# EAGLE schematic yacc1 (EAGLE 6.5.0)

## Sheet 1 of 3
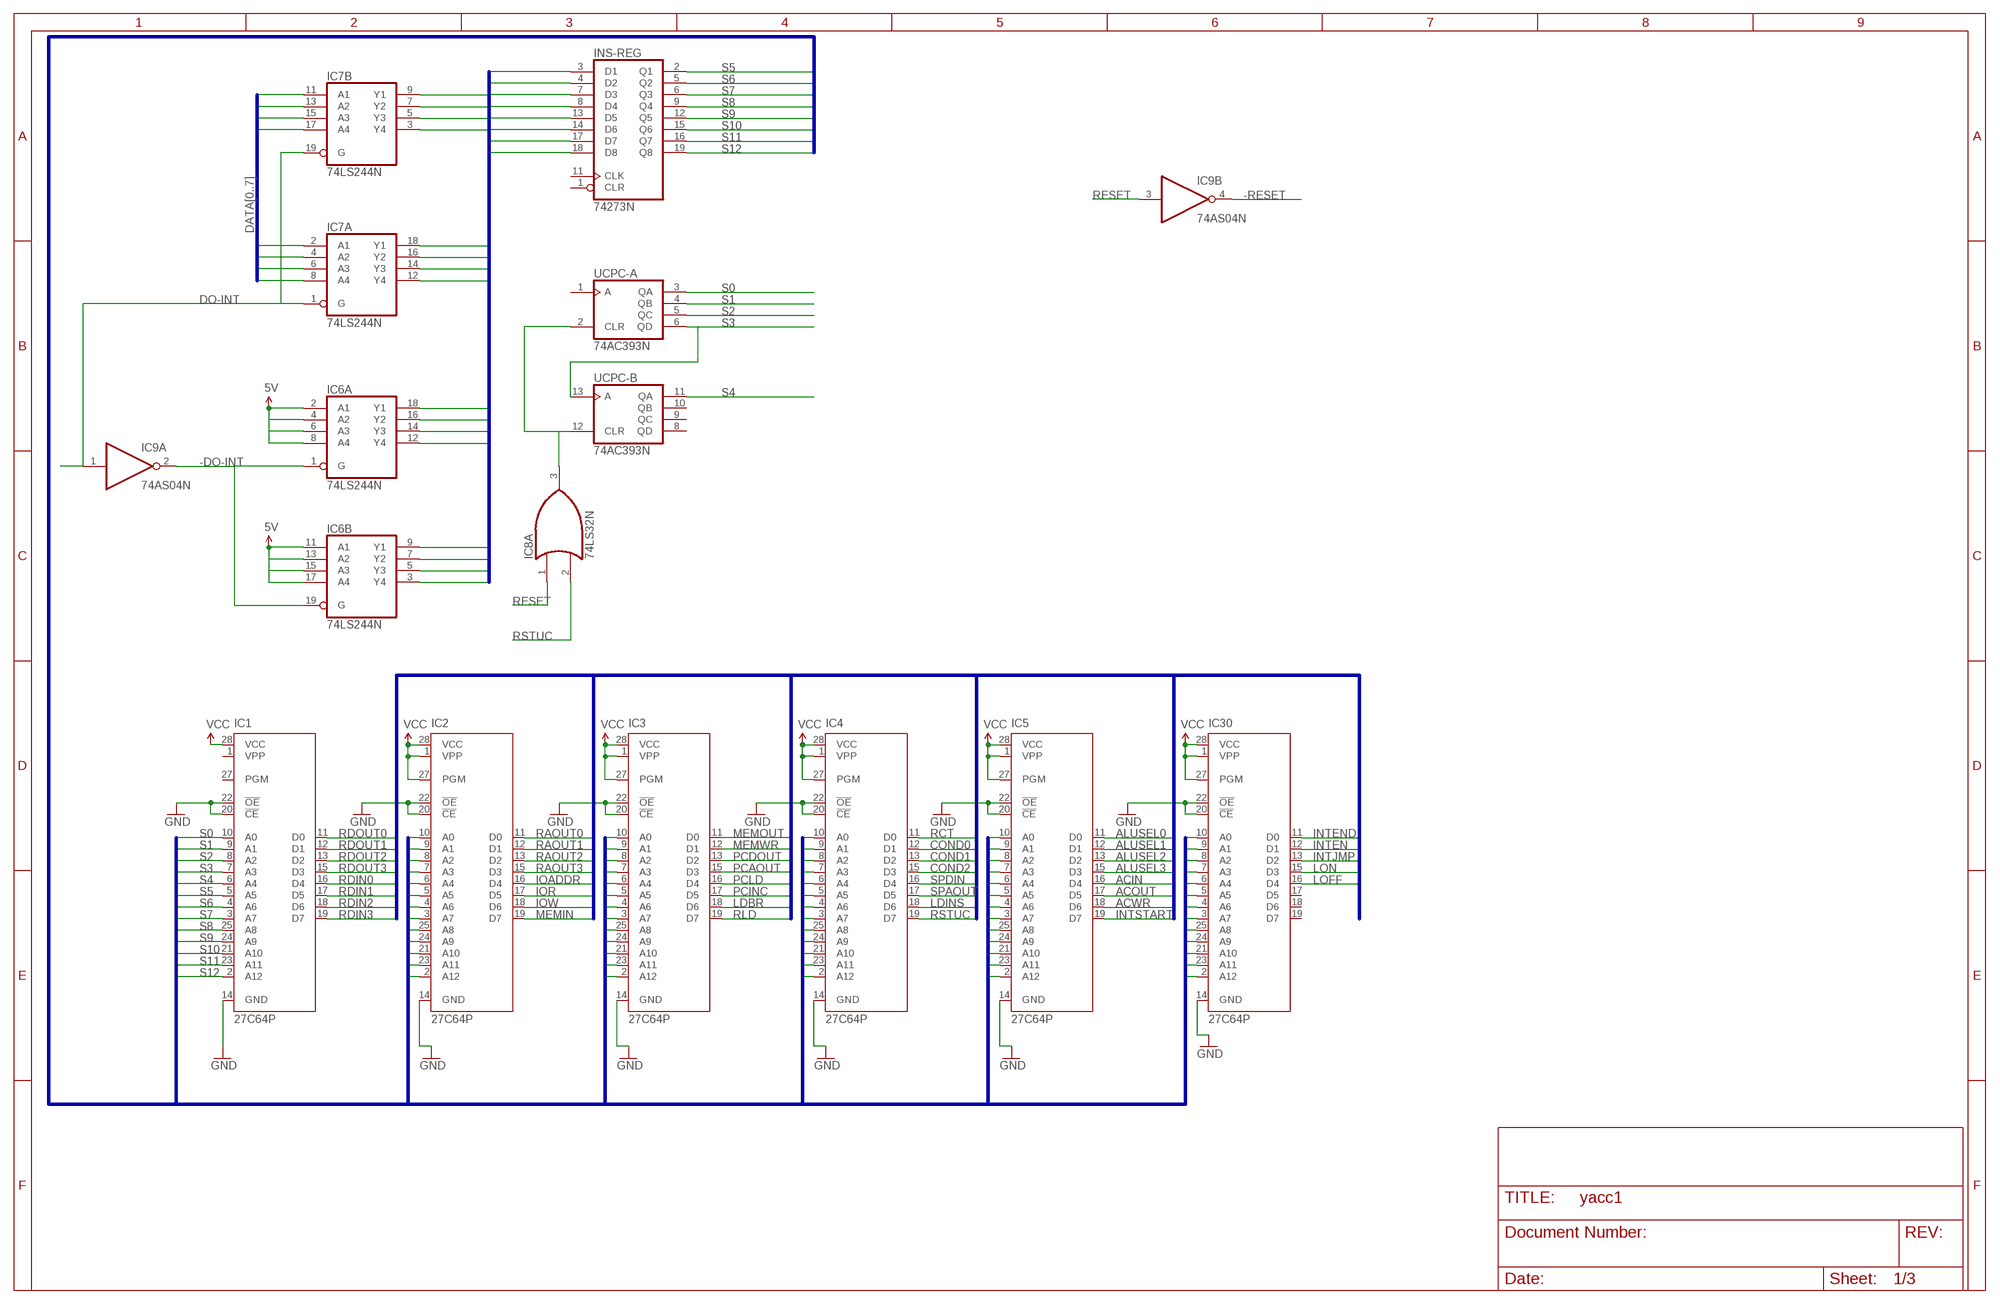
[diagram p0: schematic, sheet 1]

### Parts
IC1  27C64P  [DIL28-6]
IC2  27C64P  [DIL28-6]
IC3  27C64P  [DIL28-6]
IC4  27C64P  [DIL28-6]
IC5  27C64P  [DIL28-6]
IC6  74LS244N  [DIL20]
IC7  74LS244N  [DIL20]
IC8  74LS32N  [DIL14]
IC9  74AS04N  [DIL14]
IC30  27C64P  [DIL28-6]
INS-REG  74273N  [DIL20]
UCPC-  74AC393N  [DIL14]

### Nets
5V: IC6.2(A:A1) IC6.4(A:A2) IC6.6(A:A3) IC6.8(A:A4) IC6.11(B:A1) IC6.13(B:A2) IC6.15(B:A3) IC6.17(B:A4)
-DO-INT: IC6.1(A:G) IC6.19(B:G) IC9.2(A:O)
-RESET: IC9.4(B:O) ; also sheet 2
ACIN: IC5.16(D4)
ACOUT: IC5.17(D5)
ACWR: IC5.18(D6)
ALUSEL0: IC5.11(D0)
ALUSEL1: IC5.12(D1)
ALUSEL2: IC5.13(D2)
ALUSEL3: IC5.15(D3)
COND0: IC4.12(D1)
COND1: IC4.13(D2)
COND2: IC4.15(D3)
DATA0: IC7.11(B:A1) ; also sheet 2,3
DATA1: IC7.13(B:A2) ; also sheet 2,3
DATA2: IC7.15(B:A3) ; also sheet 2,3
DATA3: IC7.17(B:A4) ; also sheet 2,3
DATA4: IC7.2(A:A1) ; also sheet 2,3
DATA5: IC7.4(A:A2) ; also sheet 2,3
DATA6: IC7.6(A:A3) ; also sheet 2,3
DATA7: IC7.8(A:A4) ; also sheet 2,3
DINS0: IC6.18(A:Y1) IC7.9(B:Y1) INS-REG.3(D1)
DINS1: IC6.16(A:Y2) IC7.7(B:Y2) INS-REG.4(D2)
DINS2: IC6.14(A:Y3) IC7.5(B:Y3) INS-REG.7(D3)
DINS3: IC6.12(A:Y4) IC7.3(B:Y4) INS-REG.8(D4)
DINS4: IC6.9(B:Y1) IC7.18(A:Y1) INS-REG.13(D5)
DINS5: IC6.7(B:Y2) IC7.16(A:Y2) INS-REG.14(D6)
DINS6: IC6.5(B:Y3) IC7.14(A:Y3) INS-REG.17(D7)
DINS7: IC6.3(B:Y4) IC7.12(A:Y4) INS-REG.18(D8)
DO-INT: IC7.1(A:G) IC7.19(B:G) IC9.1(A:I)
GND: IC1.14(GND) IC1.20(!CE) IC1.22(!OE) IC2.14(GND) IC2.20(!CE) IC2.22(!OE) IC3.14(GND) IC3.20(!CE) IC3.22(!OE) IC4.14(GND) IC4.20(!CE) IC4.22(!OE) IC5.14(GND) IC5.20(!CE) IC5.22(!OE) IC30.14(GND) IC30.20(!CE) IC30.22(!OE)
INTEN: IC30.12(D1)
INTEND: IC30.11(D0)
INTJMP: IC30.13(D2)
INTSTART: IC5.19(D7)
IOADDR: IC2.16(D4)
IOR: IC2.17(D5)
IOW: IC2.18(D6)
LDBR: IC3.18(D6)
LDINS: IC4.18(D6)
LOFF: IC30.16(D4)
LON: IC30.15(D3)
MEMIN: IC2.19(D7)
MEMOUT: IC3.11(D0)
MEMWR: IC3.12(D1)
N$1: IC8.3(A:O) UCPC-.2(A:CLR) UCPC-.12(B:CLR)
PCAOUT: IC3.15(D3) ; also sheet 3
PCDOUT: IC3.13(D2) ; also sheet 3
PCINC: IC3.17(D5)
PCLD: IC3.16(D4)
RAOUT0: IC2.11(D0) ; also sheet 2
RAOUT1: IC2.12(D1) ; also sheet 2
RAOUT2: IC2.13(D2) ; also sheet 2
RAOUT3: IC2.15(D3) ; also sheet 2
RCT: IC4.11(D0)
RDIN0: IC1.16(D4) ; also sheet 2
RDIN1: IC1.17(D5) ; also sheet 2
RDIN2: IC1.18(D6) ; also sheet 2
RDIN3: IC1.19(D7) ; also sheet 2
RDOUT0: IC1.11(D0) ; also sheet 2
RDOUT1: IC1.12(D1) ; also sheet 2
RDOUT2: IC1.13(D2) ; also sheet 2
RDOUT3: IC1.15(D3) ; also sheet 2
RESET: IC8.1(A:I0) IC9.3(B:I)
RLD: IC3.19(D7)
RSTUC: IC4.19(D7) IC8.2(A:I1)
S0: IC1.10(A0) IC2.10(A0) IC3.10(A0) IC4.10(A0) IC5.10(A0) IC30.10(A0) UCPC-.3(A:QA)
S1: IC1.9(A1) IC2.9(A1) IC3.9(A1) IC4.9(A1) IC5.9(A1) IC30.9(A1) UCPC-.4(A:QB)
S2: IC1.8(A2) IC2.8(A2) IC3.8(A2) IC4.8(A2) IC5.8(A2) IC30.8(A2) UCPC-.5(A:QC)
S3: IC1.7(A3) IC2.7(A3) IC3.7(A3) IC4.7(A3) IC5.7(A3) IC30.7(A3) UCPC-.6(A:QD) UCPC-.13(B:A)
S4: IC1.6(A4) IC2.6(A4) IC3.6(A4) IC4.6(A4) IC5.6(A4) IC30.6(A4) UCPC-.11(B:QA)
S5: IC1.5(A5) IC2.5(A5) IC3.5(A5) IC4.5(A5) IC5.5(A5) IC30.5(A5) INS-REG.2(Q1)
S6: IC1.4(A6) IC2.4(A6) IC3.4(A6) IC4.4(A6) IC5.4(A6) IC30.4(A6) INS-REG.5(Q2)
S7: IC1.3(A7) IC2.3(A7) IC3.3(A7) IC4.3(A7) IC5.3(A7) IC30.3(A7) INS-REG.6(Q3)
S8: IC1.25(A8) IC2.25(A8) IC3.25(A8) IC4.25(A8) IC5.25(A8) IC30.25(A8) INS-REG.9(Q4)
S9: IC1.24(A9) IC2.24(A9) IC3.24(A9) IC4.24(A9) IC5.24(A9) IC30.24(A9) INS-REG.12(Q5)
S10: IC1.21(A10) IC2.21(A10) IC3.21(A10) IC4.21(A10) IC5.21(A10) IC30.21(A10) INS-REG.15(Q6)
S11: IC1.23(A11) IC2.23(A11) IC3.23(A11) IC4.23(A11) IC5.23(A11) IC30.23(A11) INS-REG.16(Q7)
S12: IC1.2(A12) IC2.2(A12) IC3.2(A12) IC4.2(A12) IC5.2(A12) IC30.2(A12) INS-REG.19(Q8)
SPAOUT: IC4.17(D5) ; also sheet 3
SPDIN: IC4.16(D4)
VCC: IC1.28(VCC) IC2.1(VPP) IC2.27(PGM) IC2.28(VCC) IC3.1(VPP) IC3.27(PGM) IC3.28(VCC) IC4.1(VPP) IC4.27(PGM) IC4.28(VCC) IC5.1(VPP) IC5.27(PGM) IC5.28(VCC) IC30.1(VPP) IC30.27(PGM) IC30.28(VCC)
Unconnected: IC1.1(VPP) IC1.26(NC) IC1.27(PGM) IC2.26(NC) IC3.26(NC) IC4.26(NC) IC5.26(NC) IC8.4(B:I0) IC8.5(B:I1) IC8.6(B:O) IC8.8(C:O) IC8.9(C:I0) IC8.10(C:I1) IC8.11(D:O) IC8.12(D:I0) IC8.13(D:I1) IC9.5(C:I) IC9.6(C:O) IC9.8(D:O) IC9.9(D:I) IC9.10(E:O) IC9.11(E:I) IC9.12(F:O) IC9.13(F:I) IC30.17(D5) IC30.18(D6) IC30.19(D7) IC30.26(NC) INS-REG.1(CLR) INS-REG.11(CLK) UCPC-.1(A:A) UCPC-.8(B:QD) UCPC-.9(B:QC) UCPC-.10(B:QB)

### Buses
S[0..12]
RDOUT[0..3],RDIN[0..3],RAOUT[0..3],IOADDR,IOR,IOW,MEMIN,MEMOUT,MEMWR,MEMRD,PCDOUT,PCAOUT,PCLD,PCINC,LDBR,RLD,RCT,COND[0..2],SPDIN,SPAOUT,LDINS,RSTUC,ALUSEL[0..3],ACIN,ACOUT,ACWR,INTSTART,INTEND,INTEN,INTJMP,LON,LOFF
DINS[0..7]
DATA[0..7]

## Sheet 2 of 3
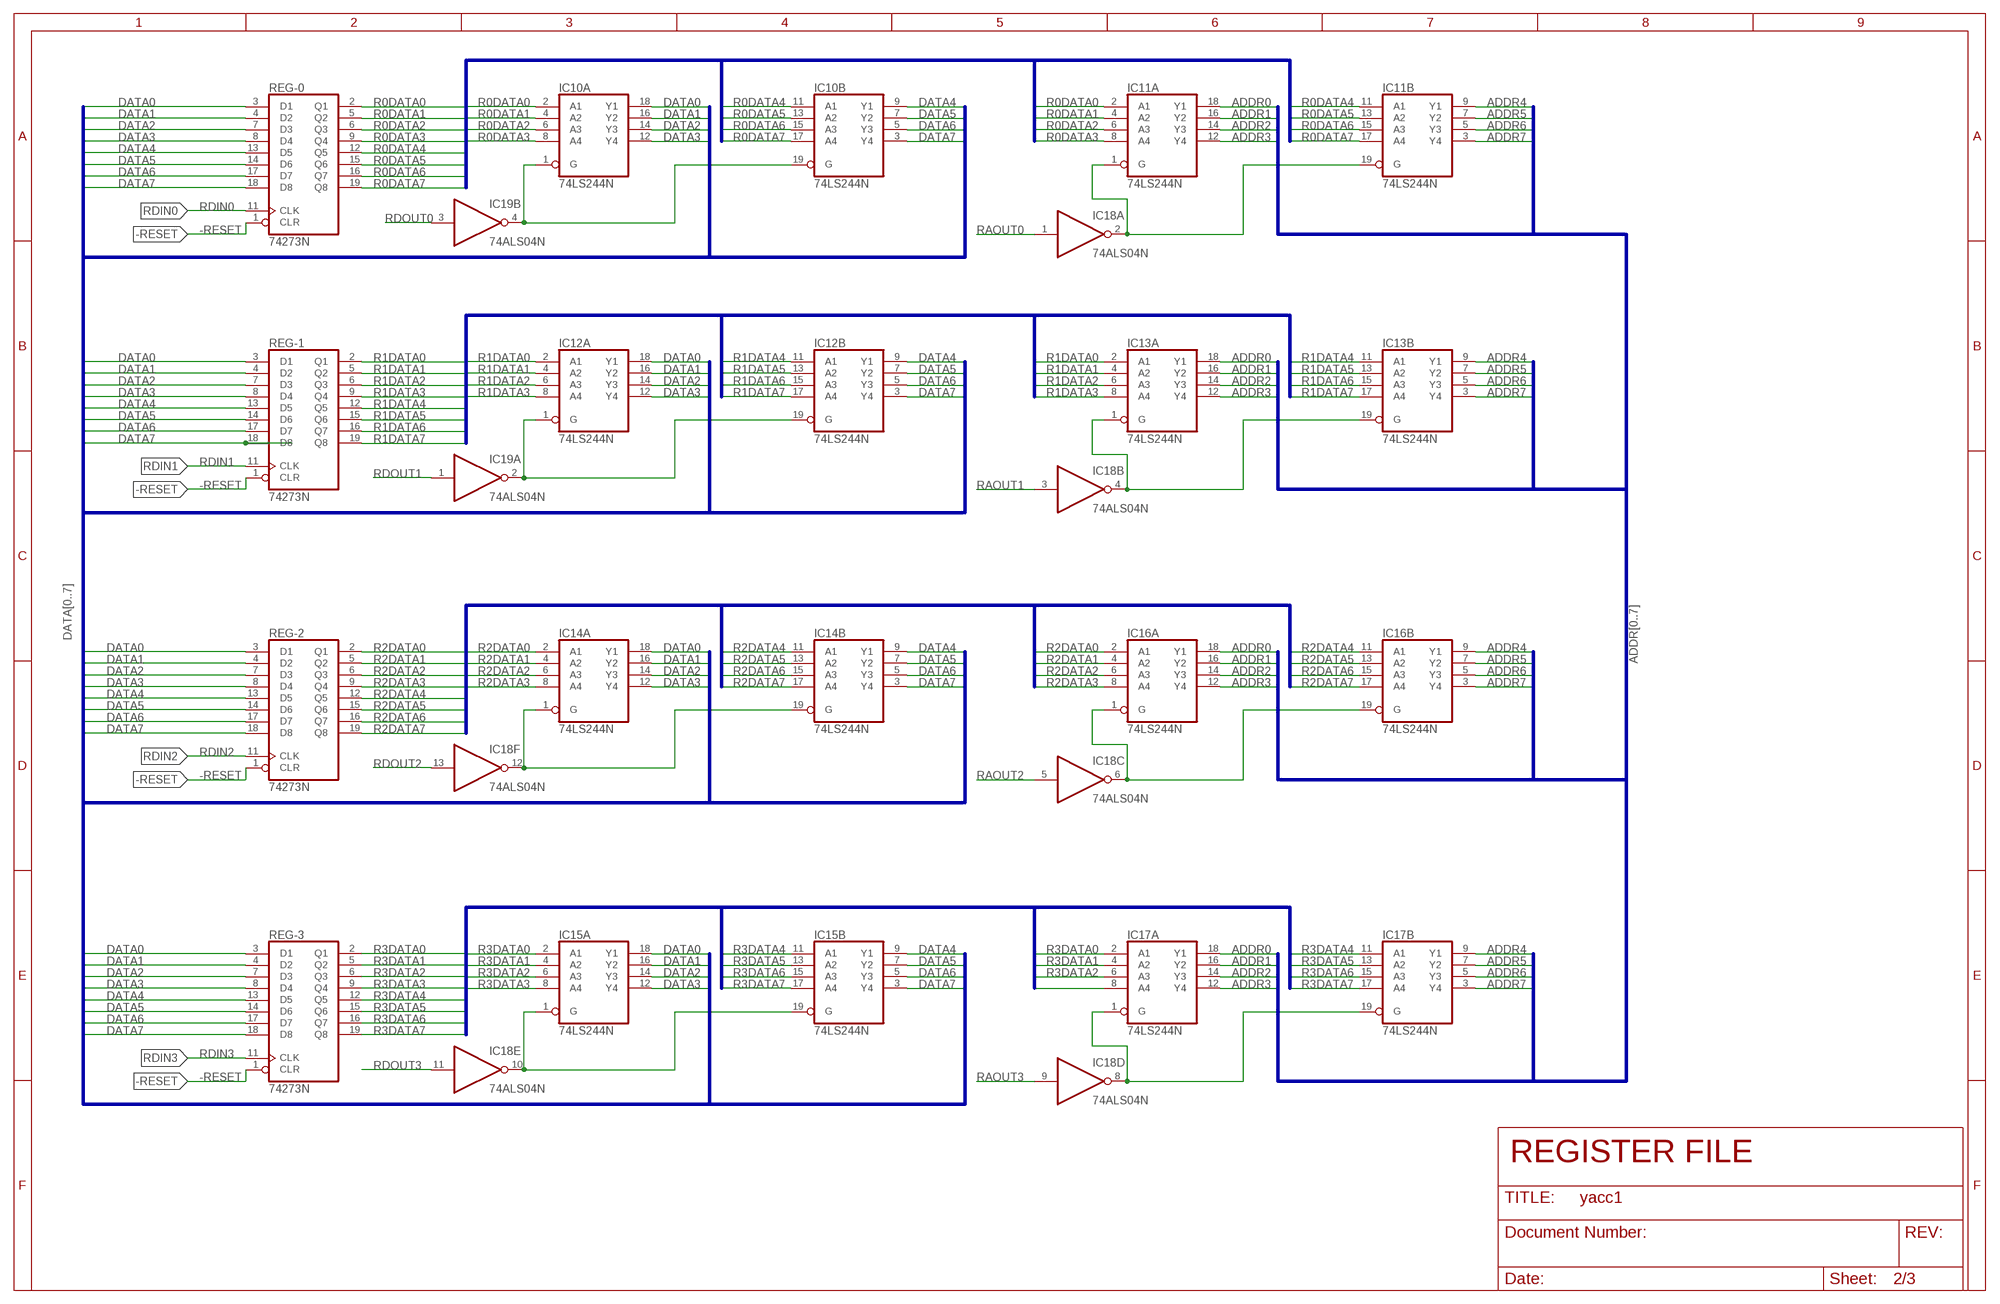
[diagram p1: schematic, sheet 2]

### Parts
IC10  74LS244N  [DIL20]
IC11  74LS244N  [DIL20]
IC12  74LS244N  [DIL20]
IC13  74LS244N  [DIL20]
IC14  74LS244N  [DIL20]
IC15  74LS244N  [DIL20]
IC16  74LS244N  [DIL20]
IC17  74LS244N  [DIL20]
IC18  74ALS04N  [DIL14]
IC19  74ALS04N  [DIL14]
REG-0  74273N  [DIL20]
REG-1  74273N  [DIL20]
REG-2  74273N  [DIL20]
REG-3  74273N  [DIL20]

### Nets
-RESET: REG-0.1(CLR) REG-1.1(CLR) REG-2.1(CLR) REG-3.1(CLR) ; also sheet 1
ADDR0: IC11.18(A:Y1) IC13.18(A:Y1) IC16.18(A:Y1) IC17.18(A:Y1) ; also sheet 3
ADDR1: IC11.16(A:Y2) IC13.16(A:Y2) IC16.16(A:Y2) IC17.16(A:Y2)
ADDR2: IC11.14(A:Y3) IC13.14(A:Y3) IC16.14(A:Y3) IC17.14(A:Y3) ; also sheet 3
ADDR3: IC11.12(A:Y4) IC13.12(A:Y4) IC16.12(A:Y4) IC17.12(A:Y4) ; also sheet 3
ADDR4: IC11.9(B:Y1) IC13.9(B:Y1) IC16.9(B:Y1) IC17.9(B:Y1) ; also sheet 3
ADDR5: IC11.7(B:Y2) IC13.7(B:Y2) IC16.7(B:Y2) IC17.7(B:Y2) ; also sheet 3
ADDR6: IC11.5(B:Y3) IC13.5(B:Y3) IC16.5(B:Y3) IC17.5(B:Y3) ; also sheet 3
ADDR7: IC11.3(B:Y4) IC13.3(B:Y4) IC16.3(B:Y4) IC17.3(B:Y4) ; also sheet 3
DATA0: IC10.18(A:Y1) IC12.18(A:Y1) IC14.18(A:Y1) IC15.18(A:Y1) REG-0.3(D1) REG-1.3(D1) REG-2.3(D1) REG-3.3(D1) ; also sheet 1,3
DATA1: IC10.16(A:Y2) IC12.16(A:Y2) IC14.16(A:Y2) IC15.16(A:Y2) REG-0.4(D2) REG-1.4(D2) REG-2.4(D2) REG-3.4(D2) ; also sheet 1,3
DATA2: IC10.14(A:Y3) IC12.14(A:Y3) IC14.14(A:Y3) IC15.14(A:Y3) REG-0.7(D3) REG-1.7(D3) REG-2.7(D3) REG-3.7(D3) ; also sheet 1,3
DATA3: IC10.12(A:Y4) IC12.12(A:Y4) IC14.12(A:Y4) IC15.12(A:Y4) REG-0.8(D4) REG-1.8(D4) REG-2.8(D4) REG-3.8(D4) ; also sheet 1,3
DATA4: IC10.9(B:Y1) IC12.9(B:Y1) IC14.9(B:Y1) IC15.9(B:Y1) REG-0.13(D5) REG-1.13(D5) REG-2.13(D5) REG-3.13(D5) ; also sheet 1,3
DATA5: IC10.7(B:Y2) IC12.7(B:Y2) IC14.7(B:Y2) IC15.7(B:Y2) REG-0.14(D6) REG-1.14(D6) REG-2.14(D6) REG-3.14(D6) ; also sheet 1,3
DATA6: IC10.5(B:Y3) IC12.5(B:Y3) IC14.5(B:Y3) IC15.5(B:Y3) REG-0.17(D7) REG-1.17(D7) REG-2.17(D7) REG-3.17(D7) ; also sheet 1,3
DATA7: IC10.3(B:Y4) IC12.3(B:Y4) IC14.3(B:Y4) IC15.3(B:Y4) REG-0.18(D8) REG-1.18(D8) REG-2.18(D8) REG-3.18(D8) ; also sheet 1,3
N$2: IC11.1(A:G) IC11.19(B:G) IC18.2(A:O)
N$3: IC13.1(A:G) IC13.19(B:G) IC18.4(B:O)
N$4: IC16.1(A:G) IC16.19(B:G) IC18.6(C:O)
N$5: IC17.1(A:G) IC17.19(B:G) IC18.8(D:O)
N$6: IC10.1(A:G) IC10.19(B:G) IC19.4(B:O)
N$7: IC12.1(A:G) IC12.19(B:G) IC19.2(A:O)
N$8: IC14.1(A:G) IC14.19(B:G) IC18.12(F:O)
N$9: IC15.1(A:G) IC15.19(B:G) IC18.10(E:O)
R0DATA0: IC10.2(A:A1) IC11.2(A:A1) REG-0.2(Q1)
R0DATA1: IC10.4(A:A2) IC11.4(A:A2) REG-0.5(Q2)
R0DATA2: IC10.6(A:A3) IC11.6(A:A3) REG-0.6(Q3)
R0DATA3: IC10.8(A:A4) IC11.8(A:A4) REG-0.9(Q4)
R0DATA4: IC10.11(B:A1) IC11.11(B:A1) REG-0.12(Q5)
R0DATA5: IC10.13(B:A2) IC11.13(B:A2) REG-0.15(Q6)
R0DATA6: IC10.15(B:A3) IC11.15(B:A3) REG-0.16(Q7)
R0DATA7: IC10.17(B:A4) IC11.17(B:A4) REG-0.19(Q8)
R1DATA0: IC12.2(A:A1) IC13.2(A:A1) REG-1.2(Q1)
R1DATA1: IC12.4(A:A2) IC13.4(A:A2) REG-1.5(Q2)
R1DATA2: IC12.6(A:A3) IC13.6(A:A3) REG-1.6(Q3)
R1DATA3: IC12.8(A:A4) IC13.8(A:A4) REG-1.9(Q4)
R1DATA4: IC12.11(B:A1) IC13.11(B:A1) REG-1.12(Q5)
R1DATA5: IC12.13(B:A2) IC13.13(B:A2) REG-1.15(Q6)
R1DATA6: IC12.15(B:A3) IC13.15(B:A3) REG-1.16(Q7)
R1DATA7: IC12.17(B:A4) IC13.17(B:A4) REG-1.19(Q8)
R2DATA0: IC14.2(A:A1) IC16.2(A:A1) REG-2.2(Q1)
R2DATA1: IC14.4(A:A2) IC16.4(A:A2) REG-2.5(Q2)
R2DATA2: IC14.6(A:A3) IC16.6(A:A3) REG-2.6(Q3)
R2DATA3: IC14.8(A:A4) IC16.8(A:A4) REG-2.9(Q4)
R2DATA4: IC14.11(B:A1) IC16.11(B:A1) REG-2.12(Q5)
R2DATA5: IC14.13(B:A2) IC16.13(B:A2) REG-2.15(Q6)
R2DATA6: IC14.15(B:A3) IC16.15(B:A3) REG-2.16(Q7)
R2DATA7: IC14.17(B:A4) IC16.17(B:A4) REG-2.19(Q8)
R3DATA0: IC15.2(A:A1) IC17.2(A:A1) REG-3.2(Q1)
R3DATA1: IC15.4(A:A2) IC17.4(A:A2) REG-3.5(Q2)
R3DATA2: IC15.6(A:A3) IC17.6(A:A3) REG-3.6(Q3)
R3DATA3: IC15.8(A:A4) IC17.8(A:A4) REG-3.9(Q4)
R3DATA4: IC15.11(B:A1) IC17.11(B:A1) REG-3.12(Q5)
R3DATA5: IC15.13(B:A2) IC17.13(B:A2) REG-3.15(Q6)
R3DATA6: IC15.15(B:A3) IC17.15(B:A3) REG-3.16(Q7)
R3DATA7: IC15.17(B:A4) IC17.17(B:A4) REG-3.19(Q8)
RAOUT0: IC18.1(A:I) ; also sheet 1
RAOUT1: IC18.3(B:I) ; also sheet 1
RAOUT2: IC18.5(C:I) ; also sheet 1
RAOUT3: IC18.9(D:I) ; also sheet 1
RDIN0: REG-0.11(CLK) ; also sheet 1
RDIN1: REG-1.11(CLK) ; also sheet 1
RDIN2: REG-2.11(CLK) ; also sheet 1
RDIN3: REG-3.11(CLK) ; also sheet 1
RDOUT0: IC19.3(B:I) ; also sheet 1
RDOUT1: IC19.1(A:I) ; also sheet 1
RDOUT2: IC18.13(F:I) ; also sheet 1
RDOUT3: IC18.11(E:I) ; also sheet 1
Unconnected: IC19.5(C:I) IC19.6(C:O) IC19.8(D:O) IC19.9(D:I) IC19.10(E:O) IC19.11(E:I) IC19.12(F:O) IC19.13(F:I)

### Buses
DATA[0..7]
ADDR[0..7]
R0DATA[0..7]
R1DATA[0..7]
R2DATA[0..7]
R3DATA[0..7]

### Notes on the sheet
- REGISTER FILE

## Sheet 3 of 3
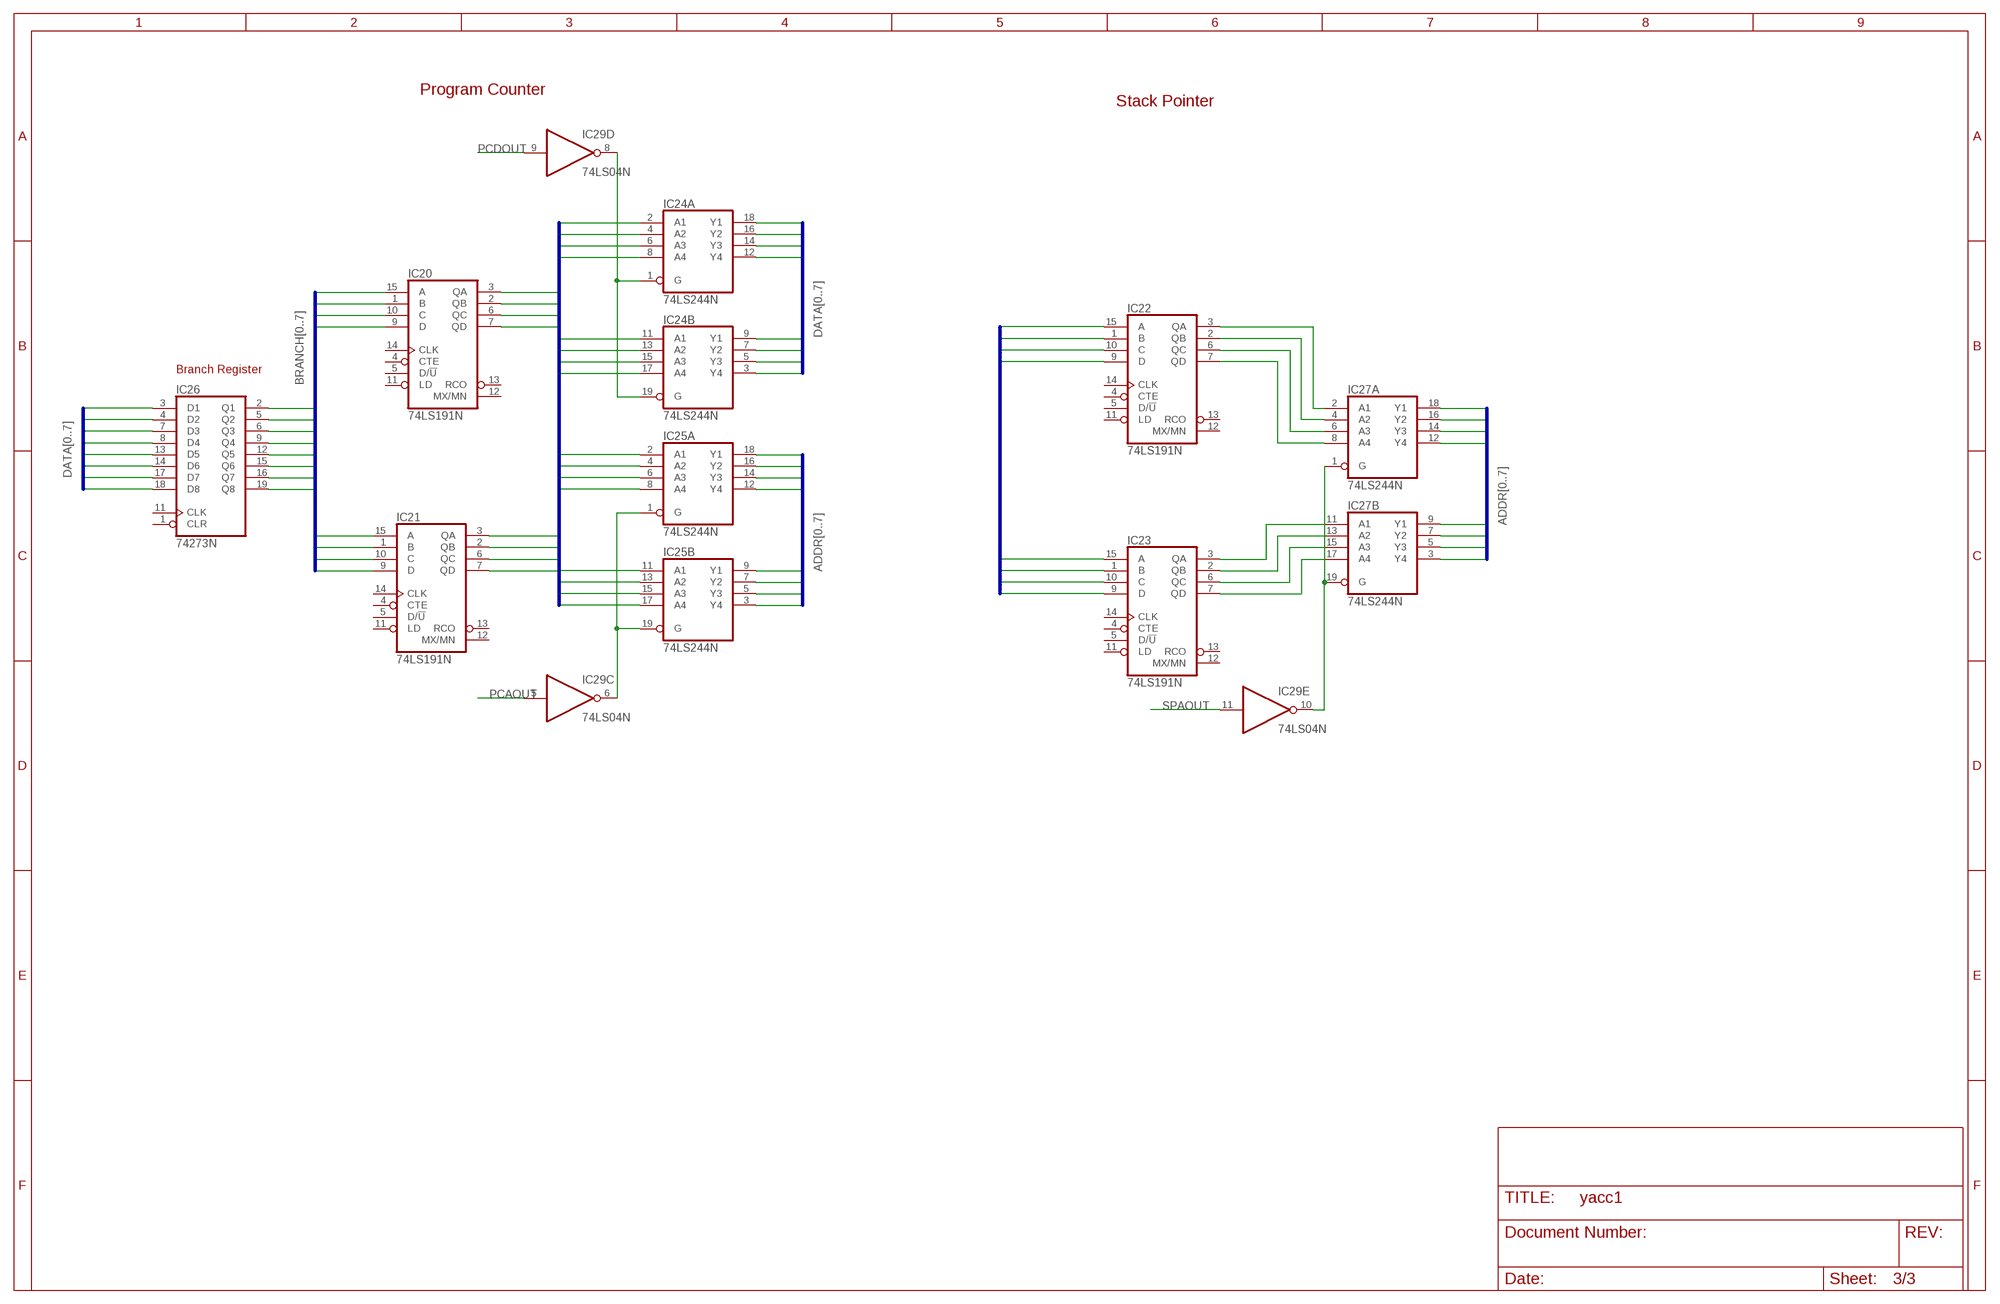
[diagram p2: schematic, sheet 3]

### Parts
IC20  74LS191N  [DIL16]
IC21  74LS191N  [DIL16]
IC22  74LS191N  [DIL16]
IC23  74LS191N  [DIL16]
IC24  74LS244N  [DIL20]
IC25  74LS244N  [DIL20]
IC26  74273N  [DIL20]
IC27  74LS244N  [DIL20]
IC29  74LS04N  [DIL14]

### Nets
ADDR0: IC25.18(A:Y1) ; also sheet 2
ADDR2: IC25.14(A:Y3) IC25.16(A:Y2) ; also sheet 2
ADDR3: IC25.12(A:Y4) ; also sheet 2
ADDR4: IC25.9(B:Y1) ; also sheet 2
ADDR5: IC25.7(B:Y2) ; also sheet 2
ADDR6: IC25.5(B:Y3) ; also sheet 2
ADDR7: IC25.3(B:Y4) ; also sheet 2
ADDR8: IC27.18(A:Y1)
ADDR9: IC27.14(A:Y3) IC27.16(A:Y2)
ADDR10: IC27.12(A:Y4)
ADDR11: IC27.9(B:Y1)
ADDR12: IC27.7(B:Y2)
ADDR13: IC27.5(B:Y3)
ADDR14: IC27.3(B:Y4)
BRANCH0: IC20.15(A) IC26.2(Q1)
BRANCH1: IC20.1(B) IC26.5(Q2)
BRANCH2: IC20.10(C) IC26.6(Q3)
BRANCH3: IC20.9(D) IC26.9(Q4)
BRANCH4: IC21.15(A) IC26.12(Q5)
BRANCH5: IC21.1(B) IC26.15(Q6)
BRANCH6: IC21.10(C) IC26.16(Q7)
BRANCH7: IC21.9(D) IC26.19(Q8)
DATA0: IC22.15(A) IC24.18(A:Y1) IC26.3(D1) ; also sheet 1,2
DATA1: IC22.1(B) IC24.16(A:Y2) IC26.4(D2) ; also sheet 1,2
DATA2: IC22.10(C) IC24.14(A:Y3) IC26.7(D3) ; also sheet 1,2
DATA3: IC22.9(D) IC24.12(A:Y4) IC26.8(D4) ; also sheet 1,2
DATA4: IC23.15(A) IC24.9(B:Y1) IC26.13(D5) ; also sheet 1,2
DATA5: IC23.1(B) IC24.7(B:Y2) IC26.14(D6) ; also sheet 1,2
DATA6: IC23.10(C) IC24.5(B:Y3) IC26.17(D7) ; also sheet 1,2
DATA7: IC23.9(D) IC24.3(B:Y4) IC26.18(D8) ; also sheet 1,2
N$10: IC22.3(QA) IC27.2(A:A1)
N$11: IC22.2(QB) IC27.4(A:A2)
N$12: IC22.6(QC) IC27.6(A:A3)
N$13: IC22.7(QD) IC27.8(A:A4)
N$14: IC23.7(QD) IC27.17(B:A4)
N$15: IC23.6(QC) IC27.15(B:A3)
N$16: IC23.2(QB) IC27.13(B:A2)
N$17: IC23.3(QA) IC27.11(B:A1)
N$19: IC24.1(A:G) IC24.19(B:G) IC29.8(D:O)
N$25: IC25.1(A:G) IC25.19(B:G) IC29.6(C:O)
N$26: IC27.1(A:G) IC27.19(B:G) IC29.10(E:O)
PC0: IC20.3(QA) IC24.2(A:A1) IC25.2(A:A1)
PC1: IC20.2(QB) IC24.4(A:A2) IC25.4(A:A2)
PC2: IC20.6(QC) IC24.6(A:A3) IC25.6(A:A3)
PC3: IC20.7(QD) IC24.8(A:A4) IC25.8(A:A4)
PC4: IC21.3(QA) IC24.11(B:A1) IC25.11(B:A1)
PC5: IC21.2(QB) IC24.13(B:A2) IC25.13(B:A2)
PC6: IC21.6(QC) IC24.15(B:A3) IC25.15(B:A3)
PC7: IC21.7(QD) IC24.17(B:A4) IC25.17(B:A4)
PCAOUT: IC29.5(C:I) ; also sheet 1
PCDOUT: IC29.9(D:I) ; also sheet 1
SPAOUT: IC29.11(E:I) ; also sheet 1
Unconnected: IC20.4(CTE) IC20.5(D/!U) IC20.11(LD) IC20.12(MX/MN) IC20.13(RCO) IC20.14(CLK) IC21.4(CTE) IC21.5(D/!U) IC21.11(LD) IC21.12(MX/MN) IC21.13(RCO) IC21.14(CLK) IC22.4(CTE) IC22.5(D/!U) IC22.11(LD) IC22.12(MX/MN) IC22.13(RCO) IC22.14(CLK) IC23.4(CTE) IC23.5(D/!U) IC23.11(LD) IC23.12(MX/MN) IC23.13(RCO) IC23.14(CLK) IC26.1(CLR) IC26.11(CLK) IC29.1(A:I) IC29.2(A:O) IC29.3(B:I) IC29.4(B:O) IC29.12(F:O) IC29.13(F:I)

### Buses
DATA[0..7]
ADDR[0..7]
PC[0..7]
BRANCH[0..7]

### Notes on the sheet
- Program Counter
- Stack Pointer
- Branch Register

## Power pins joined to a net without a drawn wire
GND: IC6.10(P:GND) IC7.10(P:GND) IC8.7(P:GND) IC9.7(P:GND) IC10.10(P:GND) IC11.10(P:GND) IC12.10(P:GND) IC13.10(P:GND) IC14.10(P:GND) IC15.10(P:GND) IC16.10(P:GND) IC17.10(P:GND) IC18.7(P:GND) IC19.7(P:GND) IC20.8(GND) IC21.8(GND) IC22.8(GND) IC23.8(GND) IC24.10(P:GND) IC25.10(P:GND) IC26.10(GND) IC27.10(P:GND) IC29.7(P:GND) INS-REG.10(GND) REG-0.10(GND) REG-1.10(GND) REG-2.10(GND) REG-3.10(GND) UCPC-.7(P:GND)
VCC: IC6.20(P:VCC) IC7.20(P:VCC) IC8.14(P:VCC) IC9.14(P:VCC) IC10.20(P:VCC) IC11.20(P:VCC) IC12.20(P:VCC) IC13.20(P:VCC) IC14.20(P:VCC) IC15.20(P:VCC) IC16.20(P:VCC) IC17.20(P:VCC) IC18.14(P:VCC) IC19.14(P:VCC) IC20.16(VCC) IC21.16(VCC) IC22.16(VCC) IC23.16(VCC) IC24.20(P:VCC) IC25.20(P:VCC) IC26.20(VCC) IC27.20(P:VCC) IC29.14(P:VCC) INS-REG.20(VCC) REG-0.20(VCC) REG-1.20(VCC) REG-2.20(VCC) REG-3.20(VCC) UCPC-.14(P:VCC)

## Library data of the parts
IC1-IC5 IC30 = microchip:27*64: CMOS EPROM 64 K (8 K x 8), low voltage; MF: Arrow Electronics; MPN: M27C64A-10F1; OC_FARNELL: 1094265; OC_NEWARK: 93K7339
IC6 IC7 IC10-IC17 IC24 IC25 IC27 = 74xx-us:74*244: Octal BUFFER and LINE DRIVER, 3-state
IC8 = 74xx-us:74*32: Quad 2-input OR gate
IC9 IC18 IC19 IC29 = 74xx-us:74*04: Hex INVERTER
IC20-IC23 = 74xx-us:74*191: Synchronous UP/DOWN COUNTER
IC26 INS-REG REG-0 REG-1-REG-3 = 74xx-us:74*273: Octal D type FLIP FLOP, clear
UCPC- = 74xx-eu:74*393: Dual 4-bit decade and binary COUNTER